# Altium schematic sheet AUDIO_MICROPHONE.SchDoc: Microphone Amplifier
size A4; Organization: Altium Limited.; Address1: Level 3, 12a Rodborough Rd; Address2: Frenchs Forest 2086; Address3: NSW; Address4: AUSTRALIA; SheetNumber: 1; SheetTotal: 100
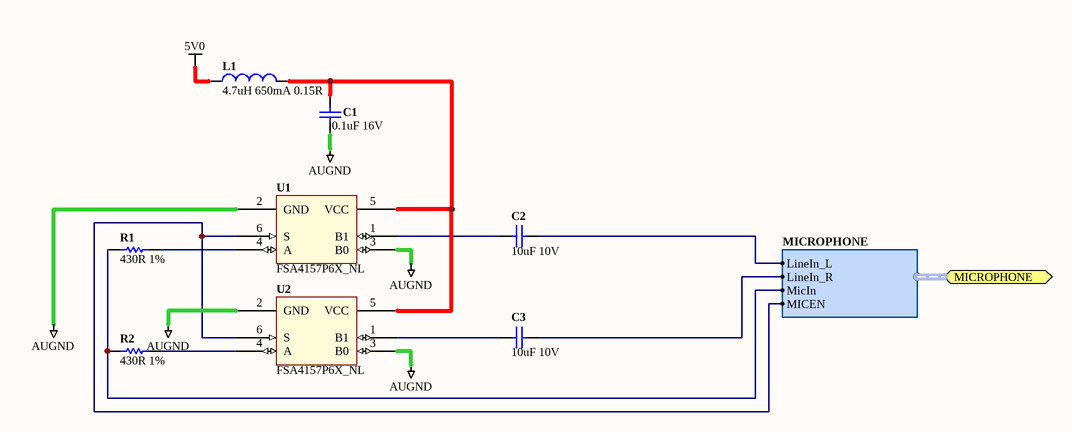
[diagram p0: AUDIO_MICROPHONE.SchDoc]

## Parts
C1  0.1uF 16V  [CAPC1005-STAR]
C2  10uF 10V  [CAPC2012-STAR]
C3  10uF 10V  [CAPC2012-STAR]
L1  4.7uH 650mA 0.15R  [INDC3225]
R1  430R 1%  [RESC1005-STAR]
R2  430R 1%  [RESC1005-STAR]
U1  FSA4157P6X_NL  [SC70_6L]
U2  FSA4157P6X_NL  [SC70_6L]

## Ports
MICROPHONE (harness MICROPHONE)

## Harnesses
MICROPHONE: LineIn_L, LineIn_R, MicIn, MICEN

## Nets
5V0: L1.2
AUGND: C1.1 U1.2(GND) U1.3(B0) U2.2(GND) U2.3(B0)
NetC1_2: C1.2 L1.1 U1.5(VCC) U2.5(VCC)
NetC2_1: C2.1 U1.1(B1)
NetC2_2: C2.2 ; port MICROPHONE.LineIn_L
NetC3_1: C3.1 U2.1(B1)
NetC3_2: C3.2 ; port MICROPHONE.LineIn_R
NetR1_1: R1.1 R2.1 ; port MICROPHONE.MicIn
NetR1_2: R1.2 U1.4(A)
NetR2_2: R2.2 U2.4(A)
NetU1_6: U1.6(S) U2.6(S) ; port MICROPHONE.MICEN

## Notes on the sheet
- Sheet Title
- Project Title
- Size:
- Date:
- A4
- Assy:
- Time:
- Revision:
- Sheet
- of
- File:

## Library data of the parts
C1 = D-101-0080: Capacitor, Ceramic, 0.1uF 10% 16V 0402 (1005) X7R; Polarity: Non-Polarized; Capacitance: 0.1 uF; Category: Capacitor; Dielectric: X7R; Mounting Technology: Surface Mount; Rated Voltage: 16 V; Status: Production; Technology: Ceramic; Tolerance: 10 %
C2 C3 = D-101-0087: Capacitor, Ceramic, 10uF 10% 10V 0805 (2012) X5R; Polarity: Non-Polarized; Capacitance: 10 uF; Dielectric: X5R; Mounting Technology: Surface Mount; Rated Voltage: 10 V; Status: Unreleased; Technology: None; Tolerance: 10 %; Category: Capacitor
L1 = D-102-0005: Inductor, 4.7uH 650mA 0.15R 1210 (3225) LQH32CN4R7M11L; Category: Inductor; Status: Production
R1 R2 = D-100-0096: Resistor, 430R 1% 0402 (1005); Power Rating: 63 mW; Category: Resistor; Mounting Technology: Surface Mount; Resistance: 430 R; Status: Production; Tolerance: 1 %
U1 U2 = D-200-0006: Low Voltage 1R  SPDT Analog Switch, SC70-6, 1.65-5.5v; Mounting Technology: Surface Mount; Status: Unreleased; Supply Voltage: 1.65 - 5.5 V; Temperature Range: -40 TO +85; Category: IC-Analog